# Altium project IR_ToF_Module.PrjPcb
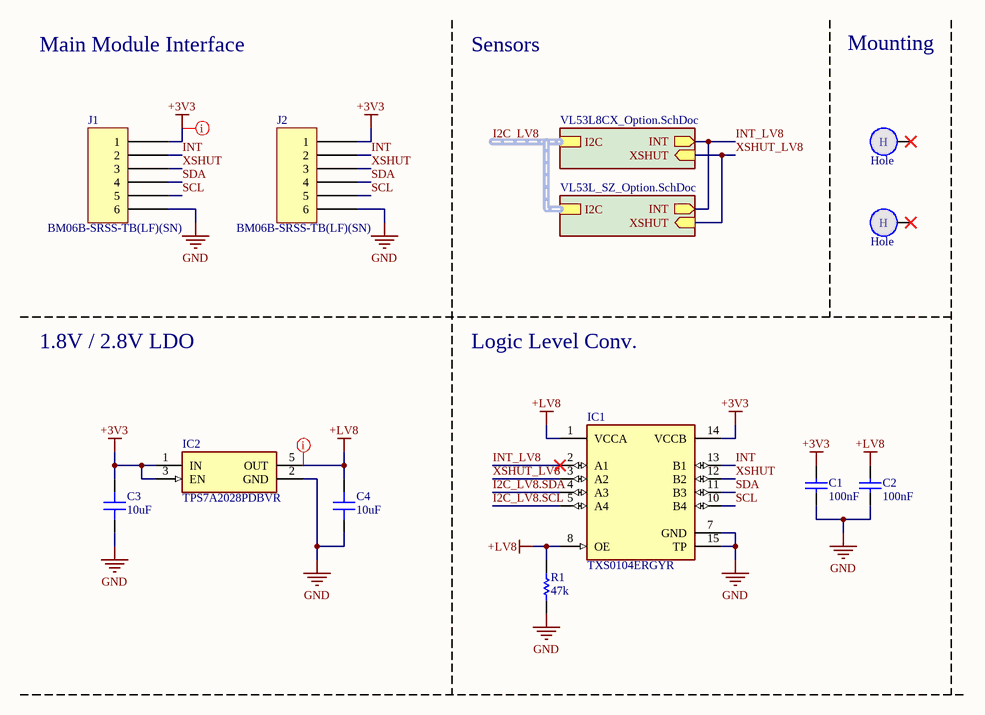
[diagram p0: IR_ToF_Module.SchDoc]
MainProjectName: The ROS Robot Project
2 sheets, 17 parts. Net scope: hierarchical (ports join the sheet entries above them; power ports are global).
Board file: IR_ToF_Module.PcbDoc
Sheets:
  IR_ToF_Module.SchDoc
    VL53L8CX = VL53L8CX_Option.SchDoc

## Sheet IR_ToF_Module.SchDoc: IR ToF Sensor Module
size A4; DrawnBy: Samyar Sadat Akhavi; Revision: 1.0; SheetNumber: 1; SheetTotal: 3

### Parts
(Parts that share a designator on the sheet are numbered #1, #2 ... from top to bottom, then left to right.)
?#1  (no value)  (graphical)
C1  100nF  [CAP_SMD_603]
C2  100nF  [CAP_SMD_603]
C3  10uF  [CAP 0805_2012]
C4  10uF  [CAP 0805_2012]
Hole1  Hole  [Hole_2mm]  (no BOM)
Hole2  Hole  [Hole_2mm]  (no BOM)
IC1  TXS0104ERGYR  [RGY(S-PVQFN-N14)]
IC2  TPS7A2028PDBVR  [SOT95P280X145-5N]
J1  BM06B-SRSS-TB(LF)(SN)  [JST BM06B-SRSS-TB]
J2  BM06B-SRSS-TB(LF)(SN)  [JST BM06B-SRSS-TB]
R1  47k  [RES_0603]

### Sub-sheets
VL53L8CX = VL53L8CX_Option.SchDoc: INT (out), XSHUT (in), I2C (harness I2C)
VL53L_SZ = VL53L_SZ_Option.SchDoc (file not in this document): INT (out), XSHUT (in), I2C (harness I2C)

### Nets
+3V3: C1.2 C3.1 IC1.14(VCCB) IC2.1(IN) IC2.3(EN) J1.1 J2.1
+LV8: C2.2 C4.1 IC1.1(VCCA) IC1.8(OE) IC2.5(OUT) R1.1
GND: C1.1 C2.1 C3.2 C4.2 IC1.7(GND) IC1.15(TP) IC2.2(GND) J1.6 J2.6 R1.2
I2C_LV8.SCL: IC1.5(A4)
I2C_LV8.SDA: IC1.4(A3)
INT: IC1.13(B1) J1.2 J2.2
INT_LV8: IC1.2(A1) ; sheet VL53L8CX/INT, sheet VL53L_SZ/INT
SCL: IC1.10(B4) J1.5 J2.5
SDA: IC1.11(B3) J1.4 J2.4
XSHUT: IC1.12(B2) J1.3 J2.3
XSHUT_LV8: IC1.3(A2) ; sheet VL53L8CX/XSHUT, sheet VL53L_SZ/XSHUT

Not connected (* = marked no-connect by the designer): Hole1 1*; Hole2 1*

### Buses and harness runs
harness I2C_LV8 = sheet VL53L8CX/I2C = sheet VL53L_SZ/I2C

### Layout directives
rule Supply Nets [Voltage = 3.300]: +3V3
rule Supply Nets [Voltage = 2.800]: +LV8

### Notes on the sheet
- Main Module Interface
- Sensors
- Mounting
- 1.8V / 2.8V LDO
- Logic Level Conv.
- Sub-Project:
- Size:
- Drawn By:
- Revision:
- Date:
- File:
- Sheet:
- of
- (in symbol Hole) H

### Library data of the parts
?#1 = Standard Title Block
C1 C2 = Non-polar Capacitor: Generic Ceramic Capacitor; Voltage: 6.3V; Value: 100nF
C3 C4 = CL21A106KOQNNNE: CAP CER 10UF 16V X5R 0805; manufacturer: Samsung Electro-Mechanics; Capacitance: 10 µF; Tolerance: ±10%; Part Number: CL21A106KOQNNNE; Applications: General Purpose; componentlink1description: Datasheet; componentlink1url: http://www.samsungsem.com/kr/support/product-search/mlcc/CL21A106KOQNNNE.jsp; componentlink2description: DigiKey Link; componentlink2url: https://www.digikey.com/en/products/detail/samsung-electro-mechanics/CL21A106KOQNNNE/3886754; Device Package: 0805 (2012 Metric); lastupdated: 2/9/2024 8:15:37 PM; Lifecycle Status: Active; Minimum Order: 1; Mounting Type: Surface Mount, MLCC; Operating Temperature: -55°C ~ 85°C; Package / Case: 0805 (2012 Metric); packaging: TapeAndReel; partid: 14297; Part Status: Active; price: 0.01; series: CL; Size / Dimension: 0.079" L x 0.049" W (2.00mm x 1.25mm); Supplier 1: DigiKey; Supplier Part Number 1: 1276-1096-1-ND; Temperature Coefficient: X5R; Thickness (Max): 0.055" (1.40mm); value: 10uF; Voltage - Rated: 16V
IC1 = TXS0104ERGYR: Integrated Circuit; Manufacturer_Name: Texas Instruments; Datasheet Link: http://www.ti.com/general/docs/lit/getliterature.tsp?genericPartNumber=TXS0104E&&fileType=pdf; Manufacturer_Part_Number: TXS0104ERGYR; Mouser Part Number: 595-TXS0104ERGYR; Mouser Price/Stock: https://www.mouser.co.uk/ProductDetail/Texas-Instruments/TXS0104ERGYR?qs=7kv20MEVUliW1hYoQAOHUw%3D%3D; Arrow Part Number: TXS0104ERGYR; Arrow Price/Stock: https://www.arrow.com/en/products/txs0104ergyr/texas-instruments?region=nac
IC2 = TPS7A2028PDBVR: Integrated Circuit; Manufacturer_Name: Texas Instruments; Datasheet Link: https://www.ti.com/lit/ds/symlink/tps7a20.pdf?ts=1609147815506&ref_url=https%253A%252F%252Fwww.mouser.in%252F; Height: 1.45mm; Manufacturer_Part_Number: TPS7A2028PDBVR; Mouser Part Number: 595-TPS7A2028PDBVR; Mouser Price/Stock: https://www.mouser.co.uk/ProductDetail/Texas-Instruments/TPS7A2028PDBVR?qs=hd1VzrDQEGggpQylpM260g%3D%3D; Arrow Part Number: TPS7A2028PDBVR; Arrow Price/Stock: https://www.arrow.com/en/products/tps7a2028pdbvr/texas-instruments?utm_currency=USD&region=europe
J1 J2 = BM06B-SRSS-TB(LF)(SN): CONN HEADER SMD 6POS 1MM; Manufacturer: JST Sales America Inc.; Current Rating (Amps): 0.7A; Material Flammability Rating: UL94 V-0; Number of Positions: 6; Number of Positions Loaded: All; Pitch - Mating: 0.039" (1.00mm); Shrouding: Shrouded - 4 Wall; Style: Board to Cable/Wire; Voltage Rating: 50V; System: Connector; Part Number: BM06B-SRSS-TB(LF)(SN); ComponentLink1Description: Datasheet; ComponentLink1URL: http://www.jst-mfg.com/product/pdf/eng/eSH.pdf; ComponentLink2Description: DigiKey Link; ComponentLink2URL: http://digikey.com/product-detail/en/jst-sales-america-inc/BM06B-SRSS-TB-LF-SN/455-1792-1-ND/926863; Connector Type: Header; Contact Finish - Mating: Tin; Contact Finish - Post: Tin; Contact Material: Copper Alloy; Contact Shape: Square; Contact Type: Male Pin; Fastening Type: Push-Pull; Features: Solder Retention; Insulation Color: Natural; Insulation Height: 0.167" (4.25mm); Insulation Material: Polyamide (PA), Nylon; LastUpdated: 1/12/2020 10:14:30 PM; Lifecycle Status: Active; Minimum Order: 1; Mounting Type: Surface Mount; Number of Rows: 1; Operating Temperature: -25°C ~ 85°C; Packaging: TapeAndReel; PartId: 20; Part Status: Active; Price: 0.38; Series: SR; Supplier 1: DigiKey; Supplier Part Number 1: 455-1792-1-ND; Termination: Solder
R1 = Resistor: Generic Resistor; Power: 1/8W; Value: 47k

## Sheet VL53L8CX_Option.SchDoc: VL53L8CX Multi-zone
size A4; DrawnBy: Samyar Sadat Akhavi; Revision: 1.0; SheetNumber: 3; SheetTotal: 3
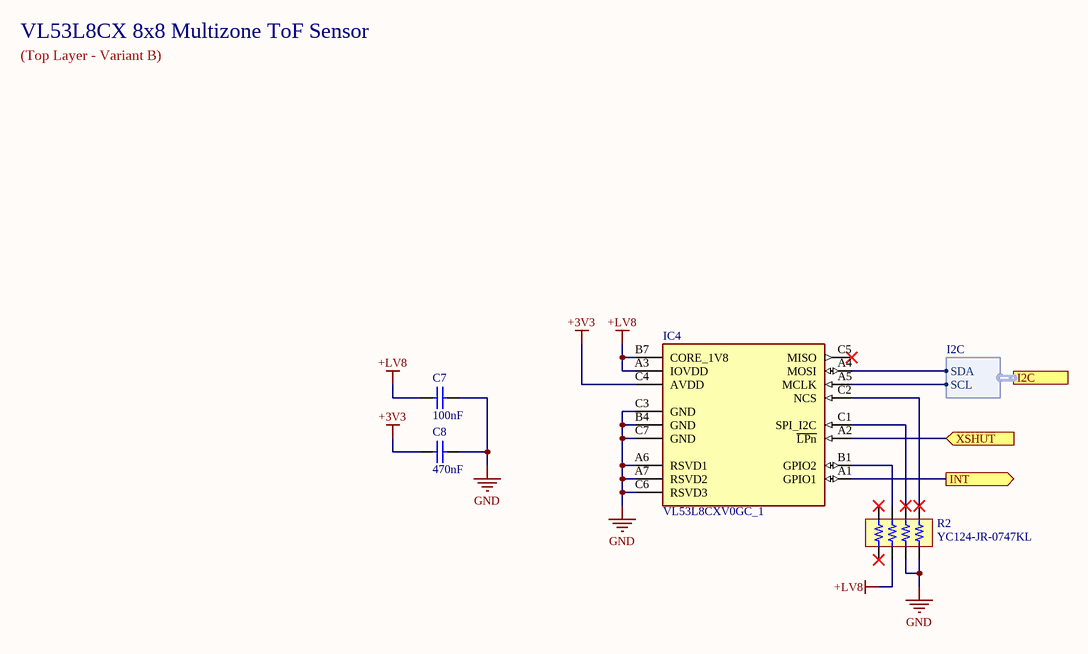
[diagram p1: VL53L8CX_Option.SchDoc]

### Parts
(Parts that share a designator on the sheet are numbered #1, #2 ... from top to bottom, then left to right.)
?#2  (no value)  (graphical)
C7  100nF  [CAP_SMD_603]
C8  470nF  [CAP_SMD_603]
IC4  VL53L8CXV0GC_1  [VL53L8CXV0GC1]
R2  YC124-JR-0747KL  [RESNET 0804-8 CONVEX]

### Ports
I2C (harness I2C, see IR_ToF_Module[2A], VL53L_SZ_Option[3B]), INT (out, see IR_ToF_Module[2A], VL53L_SZ_Option[3C]), XSHUT (in, see IR_ToF_Module[2A], VL53L_SZ_Option[3B])

### Harnesses
I2C: SDA, SCL

### Nets
+3V3: C8.2 IC4.C4(AVDD)
+LV8: C7.1 IC4.A3(IOVDD) IC4.B7(CORE_1V8) R2.2
GND: C7.2 C8.1 IC4.A6(RSVD1) IC4.A7(RSVD2) IC4.B4(GND) IC4.C3(GND) IC4.C6(RSVD3) IC4.C7(GND) R2.3 R2.4
I2C_LV8.SCL: IC4.A5(MCLK) ; port I2C.SCL
I2C_LV8.SDA: IC4.A4(MOSI) ; port I2C.SDA
INT_LV8: IC4.A1(GPIO1) ; port INT
XSHUT_LV8: IC4.A2(~{LPn}) ; port XSHUT
NetIC4_B1: IC4.B1(GPIO2) R2.7
NetIC4_C1: IC4.C1(SPI_I2C) R2.6
NetIC4_C2: IC4.C2(NCS) R2.5

Not connected (* = marked no-connect by the designer): IC4 C5(MISO)*; R2 1* 8*

### Notes on the sheet
- VL53L8CX 8x8 Multizone ToF Sensor
- (Top Layer - Variant B)
- Sub-Project:
- Size:
- Drawn By:
- Revision:
- Date:
- File:
- Sheet:
- of

### Library data of the parts
?#2 = Standard Title Block
C7 C8 = Non-polar Capacitor: Generic Ceramic Capacitor; Voltage: 6.3V
  C7: Value: 100nF
  C8: Value: 470nF
IC4 = VL53L8CXV0GC_1: Integrated Circuit; Manufacturer_Name: STMicroelectronics; Manufacturer_Part_Number: VL53L8CXV0GC/1; Datasheet Link: https://www.st.com/resource/en/datasheet/vl53l8cx.pdf; Mouser Part Number: 511-VL53L8CXV0GC/1; Mouser Price/Stock: https://www.mouser.co.uk/ProductDetail/STMicroelectronics/VL53L8CXV0GC-1?qs=T%252BzbugeAwjhc9idkQC%252BF8g%3D%3D; Arrow Part Number: VL53L8CXV0GC/1; Arrow Price/Stock: https://www.arrow.com/en/products/vl53l8cxv0gc1/stmicroelectronics?utm_currency=USD&region=europe
R2 = YC124-JR-0747KL: RES ARRAY 4 RES 47K OHM 0804; Manufacturer: Yageo; Circuit Type: Isolated; Number of Resistors: 4; Power Per Element: 62.5mW; Temperature Coefficient: ±200ppm/°C; Tolerance: ±5%; Part Number: YC124-JR-0747KL; Applications: DDRAM, SDRAM; ComponentLink1Description: Datasheet; ComponentLink1URL: https://www.yageo.com/upload/media/product/productsearch/datasheet/rchip/PYu-YC_TC_group_51_RoHS_L_9.pdf; ComponentLink2Description: DigiKey Link; ComponentLink2URL: https://www.digikey.com/en/products/detail/yageo/YC124-JR-0747KL/1005035; Height - Seated (Max): 0.022" (0.55mm); LastUpdated: 6/3/2024 8:05:56 PM; Lifecycle Status: Active; Minimum Order: 1; Mounting Type: Surface Mount; Number of Pins: 8; Operating Temperature: -55°C ~ 155°C; Package / Case: 0804, Convex, Long Side Terminals; Packaging: TapeAndReel; PartId: 481; Part Status: Active; Price: 0.01; Resistance (Ohms): 47k; Series: YC124; Size / Dimension: 0.079" L x 0.039" W (2.00mm x 1.00mm); Supplier 1: DigiKey; Supplier Part Number 1: YC124J-47KCT-ND

## Nets that join several sheets
+3V3: IR_ToF_Module (7 pins), VL53L8CX_Option (C8.2 IC4.C4)
+LV8: IR_ToF_Module (6 pins), VL53L8CX_Option (C7.1 IC4.A3 IC4.B7 R2.2)
GND: IR_ToF_Module (10 pins), VL53L8CX_Option (10 pins)
INT_LV8: IR_ToF_Module (IC1.2), VL53L8CX_Option (IC4.A1)
XSHUT_LV8: IR_ToF_Module (IC1.3), VL53L8CX_Option (IC4.A2)

## Assembly variants
VL53L8CX_Module: not fitted C6 IC3 J1; alternate parts IC2 -> TPS7A2018PDBVR
VL53L_SZ_Module: not fitted C7 C8 IC4 J2 R2